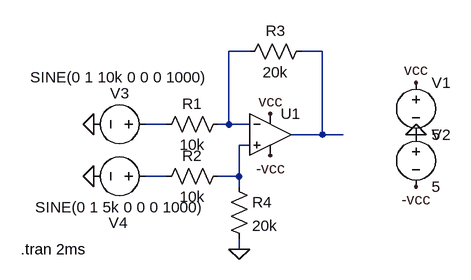
[diagram p0: schematic Stereo-to-Mono.asc]
Stereo-to-Mono.asc, the LTspice schematic file:
Version 4
SHEET 1 1012 680
WIRE 96 0 64 0
WIRE 208 0 176 0
WIRE -32 112 -64 112
WIRE 64 112 64 0
WIRE 64 112 48 112
WIRE 96 112 64 112
WIRE 208 128 208 0
WIRE 208 128 160 128
WIRE 240 128 208 128
WIRE 96 144 80 144
WIRE -32 192 -64 192
WIRE 80 192 80 144
WIRE 80 192 48 192
WIRE 80 208 80 192
WIRE 80 304 80 288
FLAG 352 48 vcc
FLAG 128 96 vcc
FLAG 352 128 0
FLAG 352 208 -vcc
FLAG 128 160 -vcc
FLAG -144 112 0
FLAG -144 192 0
FLAG 80 304 0
SYMBOL OpAmps\\UniversalOpAmp 128 128 R0
SYMATTR InstName U1
SYMBOL voltage 352 32 R0
WINDOW 123 0 0 Left 0
WINDOW 39 0 0 Left 0
SYMATTR InstName V1
SYMATTR Value 5
SYMBOL voltage 352 112 R0
WINDOW 123 0 0 Left 0
WINDOW 39 0 0 Left 0
SYMATTR InstName V2
SYMATTR Value 5
SYMBOL res 64 96 R90
WINDOW 0 0 56 VBottom 2
WINDOW 3 32 56 VTop 2
SYMATTR InstName R1
SYMATTR Value 10k
SYMBOL res 64 176 R90
WINDOW 0 0 56 VBottom 2
WINDOW 3 32 56 VTop 2
SYMATTR InstName R2
SYMATTR Value 10k
SYMBOL voltage -48 112 R90
WINDOW 0 -32 56 VBottom 2
WINDOW 3 -88 57 VTop 2
WINDOW 123 0 0 Left 0
WINDOW 39 0 0 Left 0
SYMATTR InstName V3
SYMATTR Value SINE(0 1 10k 0 0 0 1000)
SYMBOL voltage -48 192 R90
WINDOW 0 87 58 VBottom 2
WINDOW 3 32 56 VTop 2
WINDOW 123 0 0 Left 0
WINDOW 39 0 0 Left 0
SYMATTR InstName V4
SYMATTR Value SINE(0 1 5k 0 0 0 1000)
SYMBOL res 192 -16 R90
WINDOW 0 0 56 VBottom 2
WINDOW 3 32 56 VTop 2
SYMATTR InstName R3
SYMATTR Value 20k
SYMBOL res 64 192 R0
SYMATTR InstName R4
SYMATTR Value 20k
TEXT -256 304 Left 2 !.tran 2ms

The netlist it stands for:
* Stereo-to-Mono.asc
XU1 N004 N001 vcc -vcc N002 level1 Avol=1Meg GBW=10Meg Vos=0 En=0 Enk=0 In=0 Ink=0 Rin=500Meg  ; pins In+ In- V+ V- OUT
V1 vcc 0 5
V2 0 -vcc 5
R1 N001 N003 10k
R2 N004 N005 10k
V3 N003 0 SINE(0 1 10k 0 0 0 1000)
V4 N005 0 SINE(0 1 5k 0 0 0 1000)
R3 N002 N001 20k
R4 N004 0 20k
.tran 2ms
.lib UniversalOpAmp1.lib
.backanno
.end